# Altium schematic sheet Transistor_Logic.SchDoc
size A4
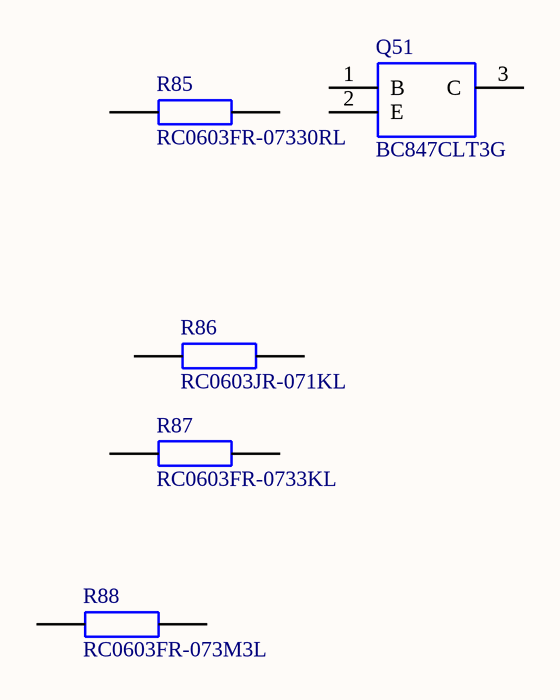
[diagram p0: Transistor_Logic.SchDoc]

## Parts
Q51  BC847CLT3G  [SOT96P237X111-3N]
R85  RC0603FR-07330RL  [RESC1608X55N]
R86  RC0603JR-071KL  [RESC1608X55N]
R87  RC0603FR-0733KL  [RESC1608X55N]
R88  RC0603FR-073M3L  [RESC1608X55N]

## Nets

Not connected (* = marked no-connect by the designer): Q51 1(B) 2(E) 3(C); R85 1 2; R86 1 2; R87 1 2; R88 1 2

## Library data of the parts
Q51 = BC847CLT3G: Manufacturer_Name: ON Semiconductor; Geometry.Height: 1.11mm; Manufacturer_Part_Number: BC847CLT3G; Arrow Part Number: BC847CLT3G; Arrow Price/Stock: https://www.arrow.com/en/products/bc847clt3g/on-semiconductor; Mouser Part Number: 863-BC847CLT3G; Mouser Price/Stock: https://www.mouser.co.uk/ProductDetail/ON-Semiconductor/BC847CLT3G?qs=vNc2DXHODiIVMr372epecQ%3D%3D; Datasheet Link: http://www.onsemi.com/pub/Collateral/BC846ALT1-D.PDF
R85 = RC0603FR-07330RL: YAGEO (PHYCOMP) - RC0603FR-07330RL - RES, THICK FILM, 330R, 1%, 0.1W, 0603; Geometry.Height: 0.55mm; Manufacturer_Name: YAGEO (PHYCOMP); Manufacturer_Part_Number: RC0603FR-07330RL; Arrow Part Number: RC0603FR-07330RL; Arrow Price/Stock: https://www.arrow.com/en/products/rc0603fr-07330rl/yageo; Mouser Part Number: 603-RC0603FR-07330RL; Mouser Price/Stock: https://www.mouser.co.uk/ProductDetail/Yageo/RC0603FR-07330RL?qs=diQw95jMAeN1335dAOzMfg%3D%3D; Datasheet Link: http://www.yageo.com/documents/recent/PYu-RC0603_51_RoHS_L_v5.pdf
R86 = RC0603JR-071KL: YAGEO (PHYCOMP) - RC0603JR-071KL - RES, THICK FILM, 1K, 5%, 0.1W, 0603; Geometry.Height: 0.55mm; Manufacturer_Name: YAGEO (PHYCOMP); Manufacturer_Part_Number: RC0603JR-071KL; Arrow Part Number: RC0603JR-071KL; Arrow Price/Stock: https://www.arrow.com/en/products/rc0603jr-071kl/yageo; Mouser Part Number: 603-RC0603JR-071KL; Mouser Price/Stock: https://www.mouser.co.uk/ProductDetail/Yageo/RC0603JR-071KL?qs=%2F9ZTgpVJnN7bctK4R%2FDEoA%3D%3D; Datasheet Link: http://www.yageo.com/documents/recent/PYu-RC0603_51_RoHS_L_v5.pdf
R87 = RC0603FR-0733KL: YAGEO (PHYCOMP) - RC0603FR-0733KL - RES, THICK FILM, 33K, 1%, 0.1W, 0603; Geometry.Height: 0.55mm; Manufacturer_Name: YAGEO (PHYCOMP); Manufacturer_Part_Number: RC0603FR-0733KL; Arrow Part Number: RC0603FR-0733KL; Arrow Price/Stock: *; Mouser Part Number: 603-RC0603FR-0733KL; Mouser Price/Stock: https://www.mouser.co.uk/ProductDetail/Yageo/RC0603FR-0733KL?qs=diQw95jMAeNLVoelhsKx3w%3D%3D; Datasheet Link: http://www.yageo.com/documents/recent/PYu-RC0603_51_RoHS_L_v5.pdf
R88 = RC0603FR-073M3L: RC0603 smt chip resistor,3M3 1% 0.1W Yageo RC Series Thick Film Surface Mount Resistor 0603 Case 3.3M +/-1% 0.1W +/-100ppm/C; Manufacturer_Name: YAGEO (PHYCOMP); Geometry.Height: 0.55mm; Manufacturer_Part_Number: RC0603FR-073M3L; Arrow Part Number: RC0603FR-073M3L; Arrow Price/Stock: *; Mouser Part Number: 603-RC0603FR-073M3L; Mouser Price/Stock: https://www.mouser.com/Search/Refine.aspx?Keyword=603-RC0603FR-073M3L; Datasheet Link: http://www.yageo.com/documents/recent/PYu-RC0603_51_RoHS_L_v5.pdf